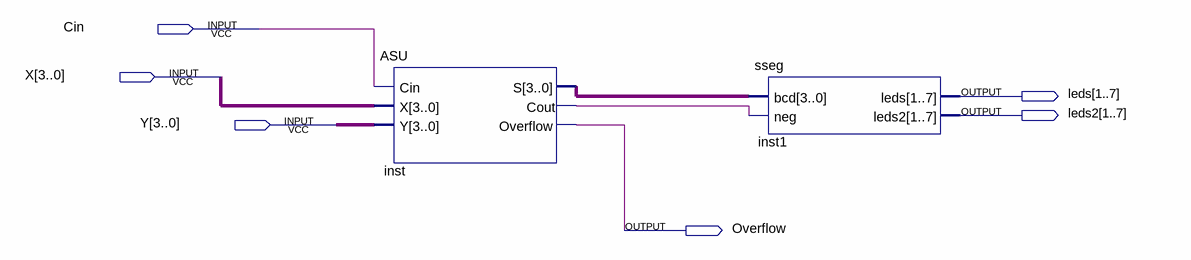
[diagram p0: schematic sheet]
// Quartus schematic CombinedASU1.bdf as structural Verilog: 2 symbols, 6 pins
module CombinedASU1 (
  input  Cin,
  input  [3:0] X,
  input  [3:0] Y,
  output [1:7] leds,
  output [1:7] leds2,
  output Overflow
);

  wire inst_cout;
  wire [3:0] inst_s;

  ASU inst (.Cin(Cin), .X(X), .Y(Y), .S(inst_s), .Cout(inst_cout), .Overflow(Overflow));
  sseg inst1 (.bcd(inst_s), .neg(inst_cout), .leds(leds), .leds2(leds2));
endmodule
